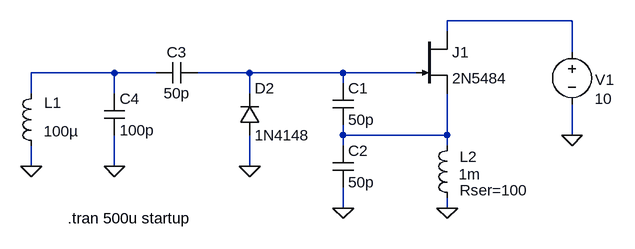
[diagram p0: schematic colpits2.asc]
colpits2.asc, the LTspice schematic file:
Version 4.1
SHEET 1 2656 2424
WIRE 2400 1968 2208 1968
WIRE 2208 1984 2208 1968
WIRE 2400 2016 2400 1968
WIRE 1696 2048 1568 2048
WIRE 1760 2048 1696 2048
WIRE 1904 2048 1824 2048
WIRE 2048 2048 1904 2048
WIRE 2160 2048 2048 2048
WIRE 2048 2064 2048 2048
WIRE 1568 2080 1568 2048
WIRE 1696 2080 1696 2048
WIRE 1904 2080 1904 2048
WIRE 2048 2144 2048 2128
WIRE 2208 2144 2208 2080
WIRE 2208 2144 2048 2144
WIRE 2400 2144 2400 2096
WIRE 2048 2160 2048 2144
WIRE 2208 2160 2208 2144
WIRE 1568 2192 1568 2160
WIRE 1696 2192 1696 2144
WIRE 1904 2192 1904 2144
WIRE 2048 2256 2048 2224
WIRE 2208 2256 2208 2240
FLAG 1568 2192 0
FLAG 2048 2256 0
FLAG 2400 2144 0
FLAG 2208 2256 0
FLAG 1696 2192 0
FLAG 1904 2192 0
SYMBOL NJF 2160 1984 R0
SYMATTR InstName J1
SYMATTR Value 2N5484
SYMBOL ind 1584 2176 R180
WINDOW 0 -4 82 Right 2
WINDOW 3 -3 38 Right 2
SYMATTR InstName L1
SYMATTR Value 100µ
SYMBOL cap 2032 2064 R0
SYMATTR InstName C1
SYMATTR Value 50p
SYMBOL cap 2032 2160 R0
SYMATTR InstName C2
SYMATTR Value 50p
SYMBOL cap 1824 2032 R90
WINDOW 0 0 32 VBottom 2
WINDOW 3 32 32 VTop 2
SYMATTR InstName C3
SYMATTR Value 50p
SYMBOL VOLTAGE 2400 2000 R0
WINDOW 123 0 0 Left 0
WINDOW 39 0 0 Left 0
WINDOW 0 36 59 Left 2
WINDOW 3 35 88 Left 2
SYMATTR InstName V1
SYMATTR Value 10
SYMBOL cap 1680 2080 R0
SYMATTR InstName C4
SYMATTR Value 100p
SYMBOL ind 2224 2256 R180
WINDOW 0 -3 79 Right 2
WINDOW 3 -2 52 Right 2
WINDOW 39 -3 27 Right 2
SYMATTR InstName L2
SYMATTR Value 1m
SYMATTR SpiceLine Rser=100
SYMBOL diode 1888 2144 M180
WINDOW 0 24 72 Left 2
WINDOW 3 24 0 Left 2
SYMATTR InstName D2
SYMATTR Value 1N4148
TEXT 1624 2272 Left 2 !.tran 500u startup

The netlist it stands for:
* colpits2.asc
J1 N001 N003 N004 2N5484
L1 0 N002 100µ
C1 N003 N004 50p
C2 N004 0 50p
C3 N003 N002 50p
V1 N001 0 10
C4 N002 0 100p
L2 0 N004 1m Rser=100
D2 0 N003 1N4148
.model D D
.lib standard.dio
.model NJF NJF
.model PJF PJF
.lib standard.jft
.tran 500u startup
.backanno
.end